# Altium schematic sheet 宁波2号线PIS_数字功率放大器_接口板(BHC-A-2030-03)_原理图_V1.0.SchDoc
size 210 x 297 mm; SheetNumber: 0; SheetTotal: 0; PageSetup: Record=PageOptions|CenterHorizontal=True|CenterVertical=True|PrintScale=0.94|XCorrection=1.00|YCorrection=1.00|PrintKind=1|BorderSize=5000000|LeftOffset=0|BottomOffset=0|Orientation=1|PaperLength=1000|PaperWidth=1000|Scale=100|PaperSource=7|PrintQuality=-4|MediaType=1|DitherType=10|PaperKind=A4|PrintScaleMode=1
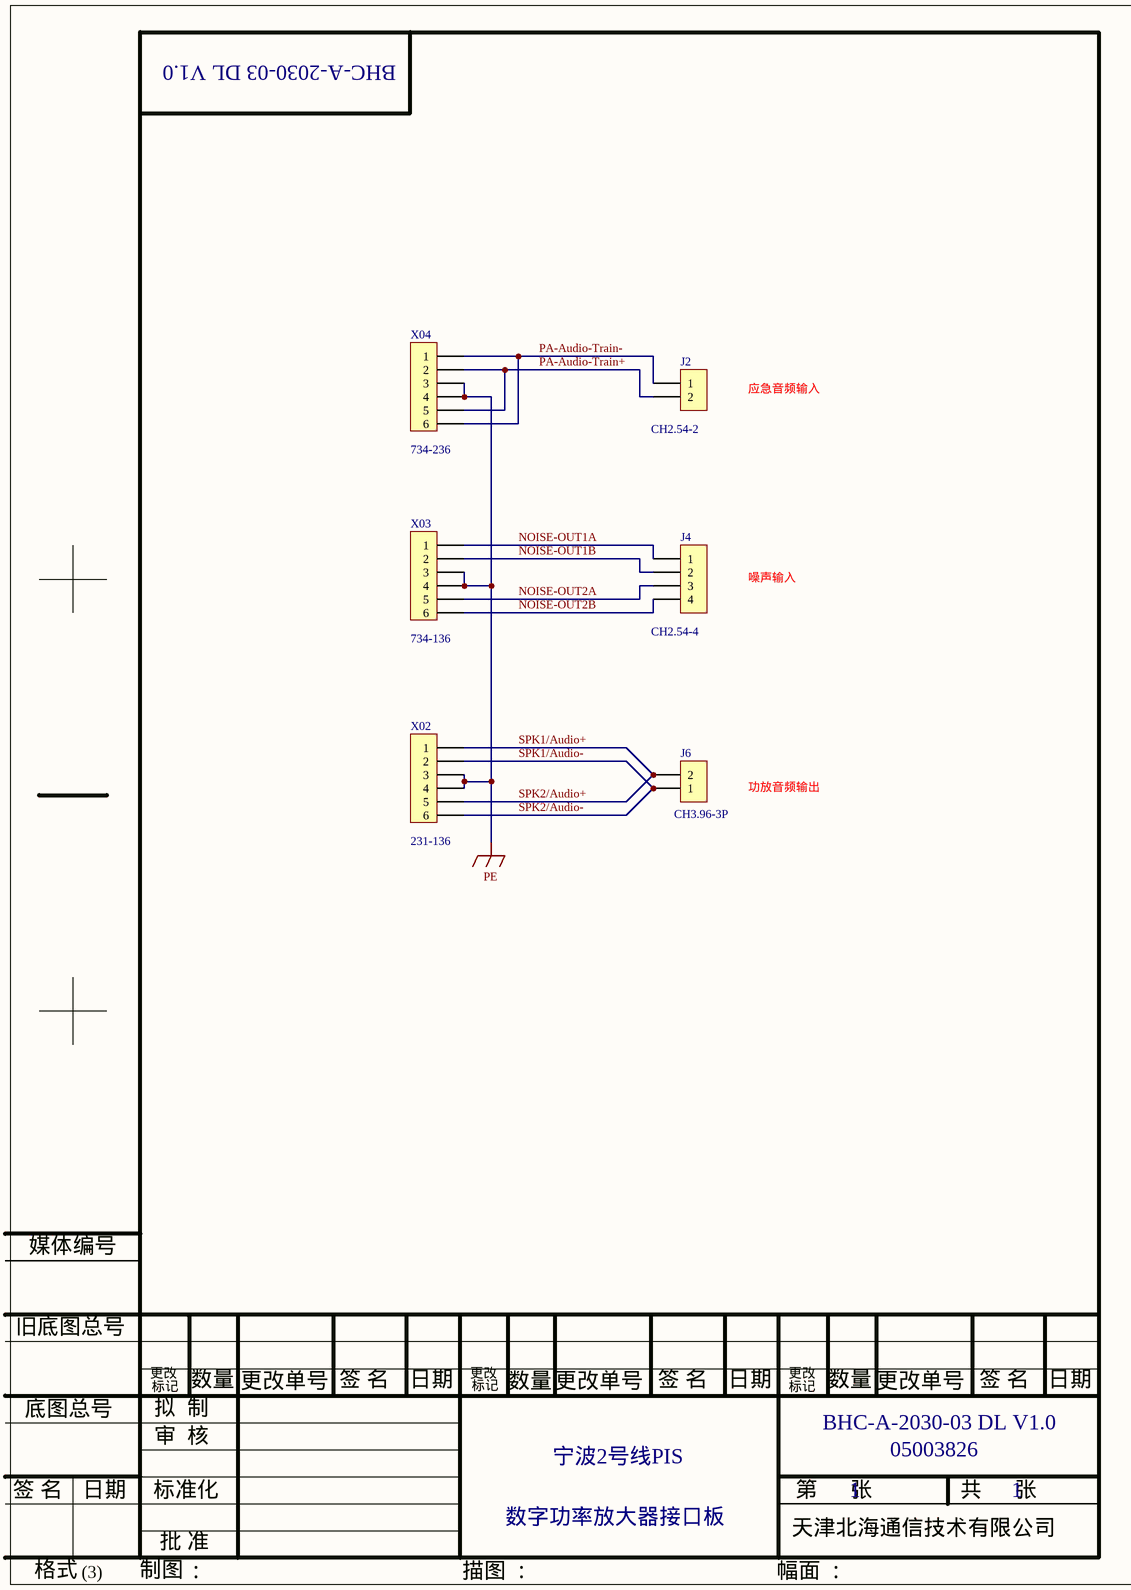
[diagram p0: 宁波2号线PIS_数字功率放大器_接口板(BHC-A-2030-03)_原理图_V1.0.SchDoc]

## Parts
J2  value CH2.54-2  [CH2.54-2]  (hidden comment: CON2)
J4  value CH2.54-4  [CH2.54-4]  (hidden comment: CON4)
J6  value CH3.96-3P  [CH3.96-3P+]  (hidden comment: CON2)
X02  231-136  [wago-231-136]
X03  734-136  [wago-734-136]
X04  734-236  [WAGO-734-236]

## Nets
PE: X02.3 X02.4 X03.3 X03.4 X04.3 X04.4
NOISE-OUT1A: J4.1 X03.1
NOISE-OUT1B: J4.2 X03.2
NOISE-OUT2A: J4.3 X03.5
NOISE-OUT2B: J4.4 X03.6
PA-Audio-Train+: J2.2 X04.2 X04.5
PA-Audio-Train-: J2.1 X04.1 X04.6
SPK1/Audio+: J6.2 X02.1 X02.5  [also labelled SPK2/Audio+]
SPK1/Audio-: J6.1 X02.2 X02.6  [also labelled SPK2/Audio-]

## Notes on the sheet
- BHC-A-2030-03 DL V1.0
- 应急音频输入
- 噪声输入
- 功放音频输出
- 宁波2号线PIS
- 05003826
- 数字功率放大器接口板
- 1
- 媒体编号
- 旧底图总号
- 更改
- 标记
- 数量
- 更改单号
- 签 名
- 日期
- 底图总号
- 拟  制
- 审  核
- 标准化
- 天津北海通信技术有限公司
- 第      张
- 共      张
- 格式
- (3)
- 制图
- 批 准
- ：
- 描图
- 幅面

## Library data of the parts
J2 J6 = CON2: Connector
X02 X03 X04 = CON6
  X02: Value: 231-136
  X03: Value: 734-136
  X04: Value: 734-236